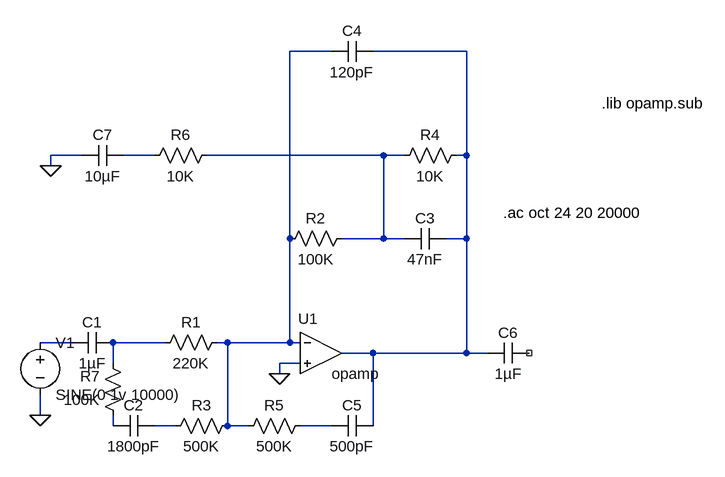
[diagram p0: schematic basspre.asc]
basspre.asc, the LTspice schematic file:
Version 4
SHEET 1 880 680
WIRE 128 -304 64 -304
WIRE 336 -304 192 -304
WIRE -256 -144 -304 -144
WIRE -144 -144 -192 -144
WIRE 208 -144 -64 -144
WIRE 240 -144 208 -144
WIRE 336 -144 336 -304
WIRE 336 -144 320 -144
WIRE -304 -128 -304 -144
WIRE 64 -16 64 -304
WIRE 208 -16 208 -144
WIRE 208 -16 144 -16
WIRE 240 -16 208 -16
WIRE 336 -16 336 -144
WIRE 336 -16 304 -16
WIRE -272 144 -320 144
WIRE -128 144 -208 144
WIRE -32 144 -48 144
WIRE 64 144 64 -16
WIRE 64 144 -32 144
WIRE 80 144 64 144
WIRE 192 160 144 160
WIRE 336 160 336 -16
WIRE 336 160 192 160
WIRE 368 160 336 160
WIRE -208 176 -208 144
WIRE 80 176 48 176
WIRE 48 192 48 176
WIRE -320 256 -320 224
WIRE -208 272 -208 256
WIRE -112 272 -144 272
WIRE -32 272 -32 144
WIRE 0 272 -32 272
WIRE 128 272 80 272
WIRE 192 272 192 160
FLAG 48 192 0
FLAG -320 256 0
FLAG -304 -128 0
SYMBOL cap -208 128 R90
WINDOW 0 0 32 VBottom 2
WINDOW 3 32 32 VTop 2
SYMATTR InstName C1
SYMATTR Value 1µF
SYMBOL cap -144 256 R90
WINDOW 0 0 32 VBottom 2
WINDOW 3 32 32 VTop 2
SYMATTR InstName C2
SYMATTR Value 1800pF
SYMBOL res -32 128 R90
WINDOW 0 0 56 VBottom 2
WINDOW 3 32 56 VTop 2
SYMATTR InstName R1
SYMATTR Value 220K
SYMBOL Opamps/opamp 112 96 R0
WINDOW 0 -35 11 Left 2
SYMATTR InstName U1
SYMBOL res 160 -32 R90
WINDOW 0 0 56 VBottom 2
WINDOW 3 32 56 VTop 2
SYMATTR InstName R2
SYMATTR Value 100K
SYMBOL cap 304 -32 R90
WINDOW 0 0 32 VBottom 2
WINDOW 3 32 32 VTop 2
SYMATTR InstName C3
SYMATTR Value 47nF
SYMBOL cap 192 -320 R90
WINDOW 0 0 32 VBottom 2
WINDOW 3 32 32 VTop 2
SYMATTR InstName C4
SYMATTR Value 120pF
SYMBOL cap 192 256 R90
WINDOW 0 0 32 VBottom 2
WINDOW 3 32 32 VTop 2
SYMATTR InstName C5
SYMATTR Value 500pF
SYMBOL cap 432 144 R90
WINDOW 0 0 32 VBottom 2
WINDOW 3 32 32 VTop 2
SYMATTR InstName C6
SYMATTR Value 1µF
SYMBOL res 336 -160 R90
WINDOW 0 0 56 VBottom 2
WINDOW 3 32 56 VTop 2
SYMATTR InstName R4
SYMATTR Value 10K
SYMBOL res -16 256 R90
WINDOW 0 0 56 VBottom 2
WINDOW 3 32 56 VTop 2
SYMATTR InstName R3
SYMATTR Value 500K
SYMBOL res 96 256 R90
WINDOW 0 0 56 VBottom 2
WINDOW 3 32 56 VTop 2
SYMATTR InstName R5
SYMATTR Value 500K
SYMBOL voltage -320 128 R0
SYMATTR InstName V1
SYMATTR Value SINE(0 1v 10000)
SYMATTR Value2 AC 1v
SYMBOL res -48 -160 R90
WINDOW 0 0 56 VBottom 2
WINDOW 3 32 56 VTop 2
SYMATTR InstName R6
SYMATTR Value 10K
SYMBOL cap -192 -160 R90
WINDOW 0 0 32 VBottom 2
WINDOW 3 32 32 VTop 2
SYMATTR InstName C7
SYMATTR Value 10µF
SYMBOL res -192 272 R180
WINDOW 0 36 76 Left 2
WINDOW 3 36 40 Left 2
SYMATTR InstName R7
SYMATTR Value 100K
TEXT 392 -56 Left 2 !.ac oct 24 20 20000
TEXT 544 -224 Left 2 !.lib opamp.sub

The netlist it stands for:
* basspre.asc
C1 N006 N005 1µF
C2 N008 N007 1800pF
R1 N001 N006 220K
XU1 N001 0 N002 opamp Aol=100K GBW=10Meg  ; pins invin noninvin out
R2 N004 N001 100K
C3 N002 N004 47nF
C4 N002 N001 120pF
C5 N002 N009 500pF
C6 NC_01 N002 1µF
R4 N002 N004 10K
R3 N001 N008 500K
R5 N009 N001 500K
V1 N005 0 SINE(0 1v 10000) AC 1v
R6 N004 N003 10K
C7 N003 0 10µF
R7 N007 N006 100K
.ac oct 24 20 20000
.lib opamp.sub
.backanno
.end